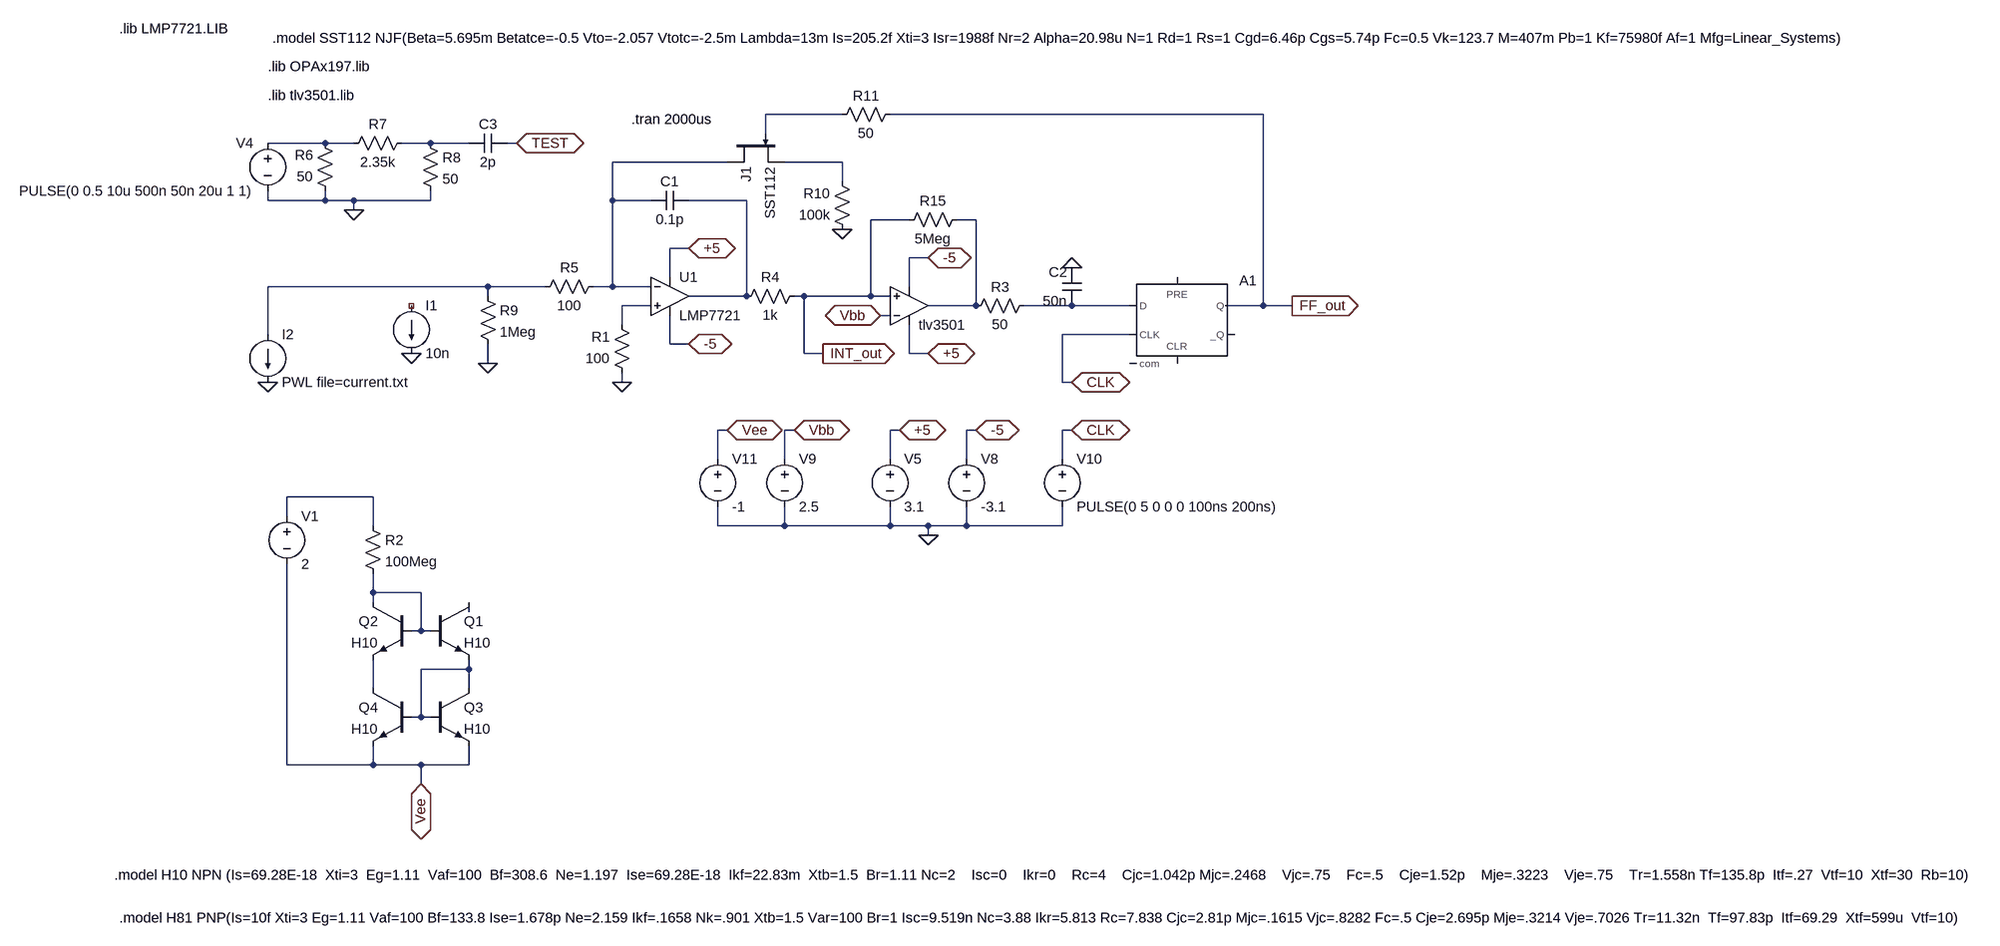
[diagram p0: schematic SAQ_SPICE.asc]
SAQ_SPICE.asc, the LTspice schematic file:
Version 4
SHEET 1 2764 1552
WIRE 384 192 256 192
WIRE 1088 192 464 192
WIRE 256 224 256 192
WIRE -480 240 -576 240
WIRE -432 240 -480 240
WIRE -304 240 -352 240
WIRE -240 240 -304 240
WIRE -160 240 -176 240
WIRE 192 272 0 272
WIRE 384 272 288 272
WIRE 384 304 384 272
WIRE -576 336 -576 320
WIRE -480 336 -480 320
WIRE -480 336 -576 336
WIRE -432 336 -480 336
WIRE -304 336 -304 320
WIRE -304 336 -432 336
WIRE 0 336 0 272
WIRE 64 336 0 336
WIRE 224 336 128 336
WIRE -432 352 -432 336
WIRE 496 368 432 368
WIRE 608 368 576 368
WIRE 128 416 96 416
WIRE 528 432 496 432
WIRE 96 464 96 416
WIRE -208 480 -576 480
WIRE -112 480 -208 480
WIRE 0 480 0 336
WIRE 0 480 -32 480
WIRE 64 480 0 480
WIRE 496 480 496 432
WIRE -208 496 -208 480
WIRE 224 496 224 336
WIRE 224 496 128 496
WIRE 320 496 304 496
WIRE 432 496 432 368
WIRE 432 496 320 496
WIRE 464 496 432 496
WIRE 64 512 16 512
WIRE 608 512 608 368
WIRE 608 512 528 512
WIRE 768 512 688 512
WIRE 864 512 768 512
WIRE 1088 512 1088 192
WIRE 1088 512 1024 512
WIRE 1136 512 1088 512
WIRE 464 528 448 528
WIRE 16 544 16 512
WIRE -576 560 -576 480
WIRE 864 560 752 560
WIRE 96 576 96 528
WIRE 128 576 96 576
WIRE 320 592 320 496
WIRE 352 592 320 592
WIRE 496 592 496 544
WIRE 528 592 496 592
WIRE -208 608 -208 576
WIRE 16 640 16 624
WIRE 752 640 752 560
WIRE 768 640 752 640
WIRE 192 720 176 720
WIRE 304 720 288 720
WIRE 480 720 464 720
WIRE 608 720 592 720
WIRE 768 720 752 720
WIRE 176 768 176 720
WIRE 288 768 288 720
WIRE 464 768 464 720
WIRE 592 768 592 720
WIRE 752 768 752 720
WIRE -400 832 -544 832
WIRE -544 864 -544 832
WIRE -400 880 -400 832
WIRE 176 880 176 848
WIRE 288 880 288 848
WIRE 288 880 176 880
WIRE 464 880 464 848
WIRE 464 880 288 880
WIRE 528 880 464 880
WIRE 592 880 592 848
WIRE 592 880 528 880
WIRE 752 880 752 848
WIRE 752 880 592 880
WIRE 528 896 528 880
WIRE -400 992 -400 960
WIRE -320 992 -400 992
WIRE -400 1008 -400 992
WIRE -240 1024 -240 1008
WIRE -320 1056 -320 992
WIRE -320 1056 -336 1056
WIRE -304 1056 -320 1056
WIRE -240 1120 -240 1104
WIRE -240 1120 -320 1120
WIRE -400 1152 -400 1104
WIRE -240 1152 -240 1120
WIRE -320 1200 -320 1120
WIRE -320 1200 -336 1200
WIRE -304 1200 -320 1200
WIRE -544 1280 -544 944
WIRE -400 1280 -400 1248
WIRE -400 1280 -544 1280
WIRE -320 1280 -400 1280
WIRE -240 1280 -240 1248
WIRE -240 1280 -320 1280
WIRE -320 1312 -320 1280
FLAG 128 576 -5
IOPIN 128 576 BiDir
FLAG 128 416 +5
IOPIN 128 416 BiDir
FLAG -160 240 TEST
IOPIN -160 240 BiDir
FLAG -432 352 0
FLAG -208 608 0
FLAG -336 592 0
FLAG 16 640 0
FLAG 528 432 -5
IOPIN 528 432 BiDir
FLAG 528 592 +5
IOPIN 528 592 BiDir
FLAG 768 640 CLK
IOPIN 768 640 BiDir
FLAG 384 384 0
FLAG 448 528 Vbb
IOPIN 448 528 BiDir
FLAG 528 896 0
FLAG 480 720 +5
IOPIN 480 720 BiDir
FLAG 608 720 -5
IOPIN 608 720 BiDir
FLAG 304 720 Vbb
IOPIN 304 720 BiDir
FLAG 768 720 CLK
IOPIN 768 720 BiDir
FLAG 192 720 Vee
IOPIN 192 720 BiDir
FLAG 1136 512 FF_out
IOPIN 1136 512 Out
FLAG 352 592 INT_out
IOPIN 352 592 Out
FLAG -576 640 0
FLAG 768 448 0
FLAG -320 1312 Vee
IOPIN -320 1312 BiDir
SYMBOL res -16 464 R90
WINDOW 0 0 56 VBottom 2
WINDOW 3 32 56 VTop 2
SYMATTR InstName R5
SYMATTR Value 100
SYMBOL res -464 336 R180
WINDOW 0 36 76 Left 2
WINDOW 3 36 40 Left 2
SYMATTR InstName R6
SYMATTR Value 50
SYMBOL res -448 256 R270
WINDOW 0 32 56 VTop 2
WINDOW 3 0 56 VBottom 2
SYMATTR InstName R7
SYMATTR Value 2.35k
SYMBOL res -320 224 R0
SYMATTR InstName R8
SYMATTR Value 50
SYMBOL voltage -576 224 M0
SYMATTR InstName V4
SYMATTR Value PULSE(0 0.5 10u 500n 50n 20u 1 1)
SYMBOL res -224 480 R0
SYMATTR InstName R9
SYMATTR Value 1Meg
SYMBOL cap -176 224 R90
WINDOW 0 0 32 VBottom 2
WINDOW 3 32 32 VTop 2
SYMATTR InstName C3
SYMATTR Value 2p
SYMBOL current -336 512 R0
SYMATTR InstName I1
SYMATTR Value 10n
SYMBOL cap 128 320 R90
WINDOW 0 0 32 VBottom 2
WINDOW 3 32 32 VTop 2
SYMATTR InstName C1
SYMATTR Value 0.1p
SYMBOL opamp2 96 432 R0
SYMATTR InstName U1
SYMATTR Value LMP7721
SYMBOL res 32 640 R180
WINDOW 0 36 76 Left 2
WINDOW 3 36 40 Left 2
SYMATTR InstName R1
SYMATTR Value 100
SYMBOL res 704 496 R90
WINDOW 0 0 56 VBottom 2
WINDOW 3 32 56 VTop 2
SYMATTR InstName R3
SYMATTR Value 50
SYMBOL res 208 512 R270
WINDOW 0 32 56 VTop 2
WINDOW 3 0 56 VBottom 2
SYMATTR InstName R4
SYMATTR Value 1k
SYMBOL dflop 944 464 R0
SYMATTR InstName A1
SYMBOL res 400 400 R180
WINDOW 0 36 76 Left 2
WINDOW 3 36 40 Left 2
SYMATTR InstName R10
SYMATTR Value 100k
SYMBOL res 368 208 R270
WINDOW 0 32 56 VTop 2
WINDOW 3 0 56 VBottom 2
SYMATTR InstName R11
SYMATTR Value 50
SYMBOL res 480 384 R270
WINDOW 0 32 56 VTop 2
WINDOW 3 0 56 VBottom 2
SYMATTR InstName R15
SYMATTR Value 5Meg
SYMBOL njf 192 224 M90
SYMATTR InstName J1
SYMATTR Value SST112
SYMBOL voltage 464 752 R0
SYMATTR InstName V5
SYMATTR Value 3.1
SYMBOL voltage 592 752 R0
SYMATTR InstName V8
SYMATTR Value -3.1
SYMBOL voltage 288 752 R0
SYMATTR InstName V9
SYMATTR Value 2.5
SYMBOL voltage 752 752 R0
SYMATTR InstName V10
SYMATTR Value PULSE(0 5 0 0 0 100ns 200ns)
SYMBOL voltage 176 752 R0
SYMATTR InstName V11
SYMATTR Value -1
SYMBOL current -576 560 R0
SYMATTR InstName I2
SYMATTR Value PWL file=current.txt
SYMBOL UniversalOpamp2 496 512 M180
SYMATTR InstName tlv3501
SYMBOL cap 784 512 R180
WINDOW 0 24 56 Left 2
WINDOW 3 24 8 Left 2
SYMATTR InstName C2
SYMATTR Value 50n
SYMBOL voltage -544 848 R0
SYMATTR InstName V1
SYMATTR Value 2
SYMBOL res -416 864 R0
SYMATTR InstName R2
SYMATTR Value 100Meg
SYMBOL npn -304 1008 R0
SYMATTR InstName Q1
SYMATTR Value H10
SYMBOL npn -336 1008 M0
SYMATTR InstName Q2
SYMATTR Value H10
SYMBOL npn -304 1152 R0
SYMATTR InstName Q3
SYMATTR Value H10
SYMBOL npn -336 1152 M0
SYMATTR InstName Q4
SYMATTR Value H10
TEXT -576 112 Left 2 !.lib OPAx197.lib
TEXT 32 200 Left 2 !.tran 2000us
TEXT -568 64 Left 2 !.model SST112 NJF(Beta=5.695m Betatce=-0.5 Vto=-2.057 Vtotc=-2.5m Lambda=13m Is=205.2f Xti=3 Isr=1988f Nr=2 Alpha=20.98u N=1 Rd=1 Rs=1 Cgd=6.46p Cgs=5.74p Fc=0.5 Vk=123.7 M=407m Pb=1 Kf=75980f Af=1 Mfg=Linear_Systems)
TEXT -576 160 Left 2 !.lib tlv3501.lib
TEXT -832 1464 Left 2 !.model H10 NPN (Is=69.28E-18  Xti=3  Eg=1.11  Vaf=100  Bf=308.6  Ne=1.197  Ise=69.28E-18  Ikf=22.83m  Xtb=1.5  Br=1.11 Nc=2    Isc=0    Ikr=0    Rc=4    Cjc=1.042p Mjc=.2468    Vjc=.75    Fc=.5    Cje=1.52p    Mje=.3223    Vje=.75    Tr=1.558n Tf=135.8p  Itf=.27  Vtf=10  Xtf=30  Rb=10)
TEXT -824 1536 Left 2 !.model H81 PNP(Is=10f Xti=3 Eg=1.11 Vaf=100 Bf=133.8 Ise=1.678p Ne=2.159 Ikf=.1658 Nk=.901 Xtb=1.5 Var=100 Br=1 Isc=9.519n Nc=3.88 Ikr=5.813 Rc=7.838 Cjc=2.81p Mjc=.1615 Vjc=.8282 Fc=.5 Cje=2.695p Mje=.3214 Vje=.7026 Tr=11.32n  Tf=97.83p  Itf=69.29  Xtf=599u  Vtf=10)
TEXT -824 48 Left 2 !.lib LMP7721.LIB

The netlist it stands for:
* SAQ_SPICE.asc
R5 N004 N008 100
R6 0 N002 50
R7 N002 N003 2.35k
R8 N003 0 50
V4 N002 0 PULSE(0 0.5 10u 500n 50n 20u 1 1)
R9 N008 0 1Meg
C3 TEST N003 2p
I1 NC_01 0 10n
C1 N006 N004 0.1p
XU1 N009 N004 +5 -5 N006 LMP7721  ; pins In+ In- V+ V- OUT
R1 0 N009 100
R3 N010 N007 50
R4 N006 INT_out 1k
A1 N010 0 CLK 0 0 0 FF_out 0 DFLOP
R10 0 N005 100k
R11 N001 FF_out 50
R15 INT_out N007 5Meg
J1 N004 N001 N005 SST112
V5 +5 0 3.1
V8 -5 0 -3.1
V9 Vbb 0 2.5
V10 CLK 0 PULSE(0 5 0 0 0 100ns 200ns)
V11 Vee 0 -1
I2 N008 0 PWL file=current.txt
Xtlv3501 INT_out Vbb +5 -5 N007 level.2 Avol=1Meg GBW=10Meg Slew=10Meg ilimit=25m rail=0 Vos=0 phimargin=45 en=0 enk=0 in=0 ink=0 Rin=500Meg  ; pins IN+ IN- V+ V- OUT
C2 N010 0 50n
V1 N011 Vee 2
R2 N011 N012 100Meg
Q1 N013 N012 N014 0 H10
Q2 N012 N012 N015 0 H10
Q3 N014 N014 Vee 0 H10
Q4 N015 N014 Vee 0 H10
.model NPN NPN
.model PNP PNP
.lib standard.bjt
.model NJF NJF
.model PJF PJF
.lib standard.jft
.lib OPAx197.lib
.tran 2000us
.model SST112 NJF(Beta=5.695m Betatce=-0.5 Vto=-2.057 Vtotc=-2.5m Lambda=13m Is=205.2f Xti=3 Isr=1988f Nr=2 Alpha=20.98u N=1 Rd=1 Rs=1 Cgd=6.46p Cgs=5.74p Fc=0.5 Vk=123.7 M=407m Pb=1 Kf=75980f Af=1 Mfg=Linear_Systems)
.lib tlv3501.lib
.model H10 NPN (Is=69.28E-18  Xti=3  Eg=1.11  Vaf=100  Bf=308.6  Ne=1.197  Ise=69.28E-18  Ikf=22.83m  Xtb=1.5  Br=1.11 Nc=2    Isc=0    Ikr=0    Rc=4    Cjc=1.042p Mjc=.2468    Vjc=.75    Fc=.5    Cje=1.52p    Mje=.3223    Vje=.75    Tr=1.558n Tf=135.8p  Itf=.27  Vtf=10  Xtf=30  Rb=10)
.model H81 PNP(Is=10f Xti=3 Eg=1.11 Vaf=100 Bf=133.8 Ise=1.678p Ne=2.159 Ikf=.1658 Nk=.901 Xtb=1.5 Var=100 Br=1 Isc=9.519n Nc=3.88 Ikr=5.813 Rc=7.838 Cjc=2.81p Mjc=.1615 Vjc=.8282 Fc=.5 Cje=2.695p Mje=.3214 Vje=.7026 Tr=11.32n  Tf=97.83p  Itf=69.29  Xtf=599u  Vtf=10)
.lib LMP7721.LIB
.lib UniversalOpamps2.sub
.backanno
.end